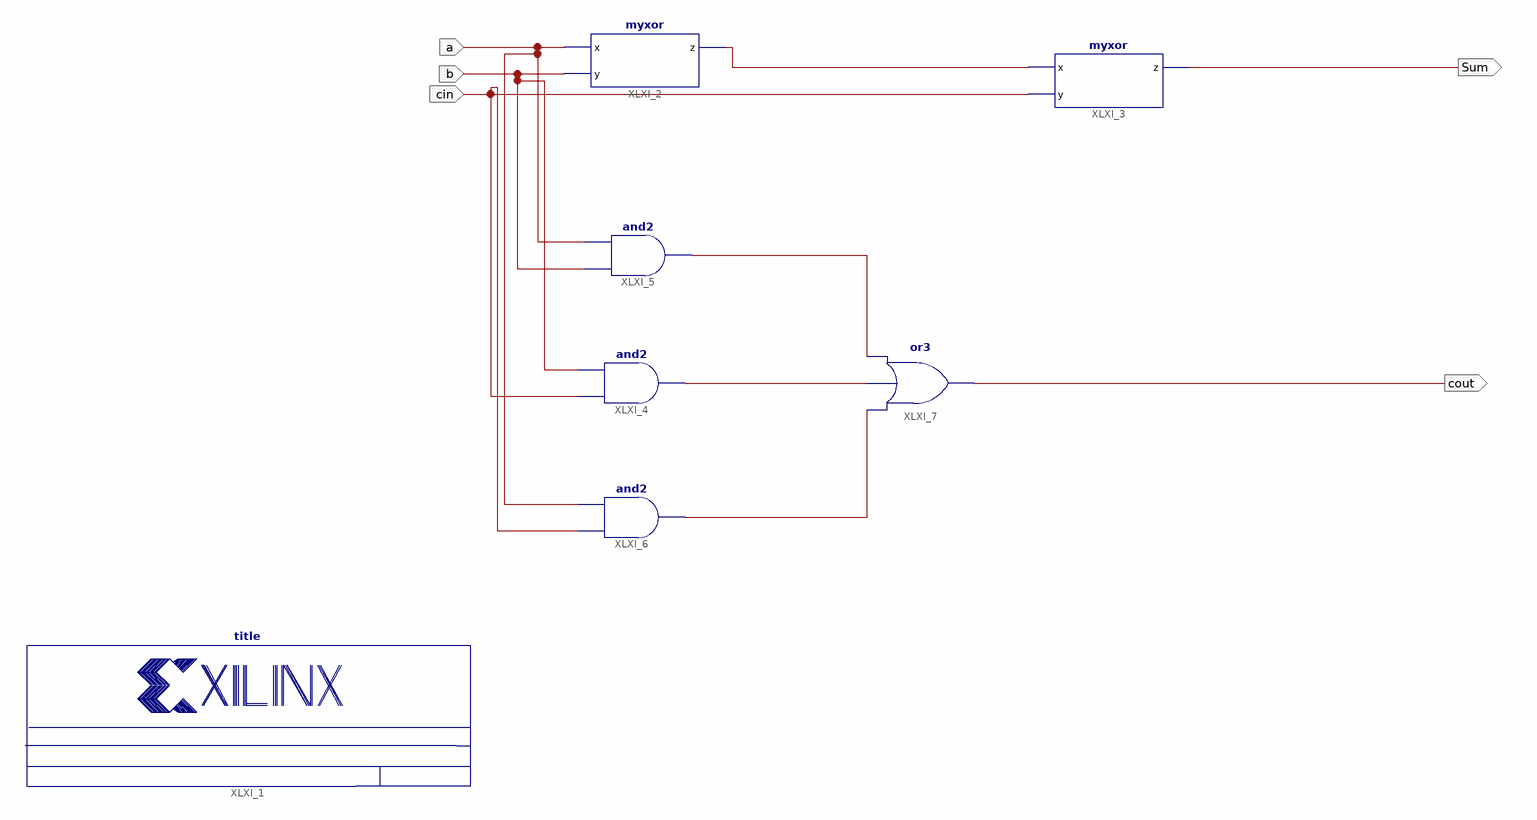
[diagram p0: schematic sheet 1]
// Xilinx ISE schematic fuller_adder_sch.sch (spartan3e) as structural Verilog: 7 symbols, 5 ports
module fuller_adder_sch (
  input  a,
  input  b,
  input  cin,
  output Sum,
  output cout
);

  wire XLXN_11, XLXN_12, XLXN_13, XLXN_15;

  title #(.NameFieldText("Full adder")) XLXI_1 ();
  myxor XLXI_2 (.x(a), .y(b), .z(XLXN_15));
  myxor XLXI_3 (.x(XLXN_15), .y(cin), .z(Sum));
  and XLXI_4 (XLXN_12, cin, b);
  and XLXI_5 (XLXN_13, b, a);
  and XLXI_6 (XLXN_11, cin, a);
  or XLXI_7 (cout, XLXN_11, XLXN_12, XLXN_13);
endmodule
